# Altium schematic sheet MosfetDrivers.SchDoc
size 420 x 297 mm; Author: Denizhan ALTAY; SheetNumber: 3; SheetTotal: 4
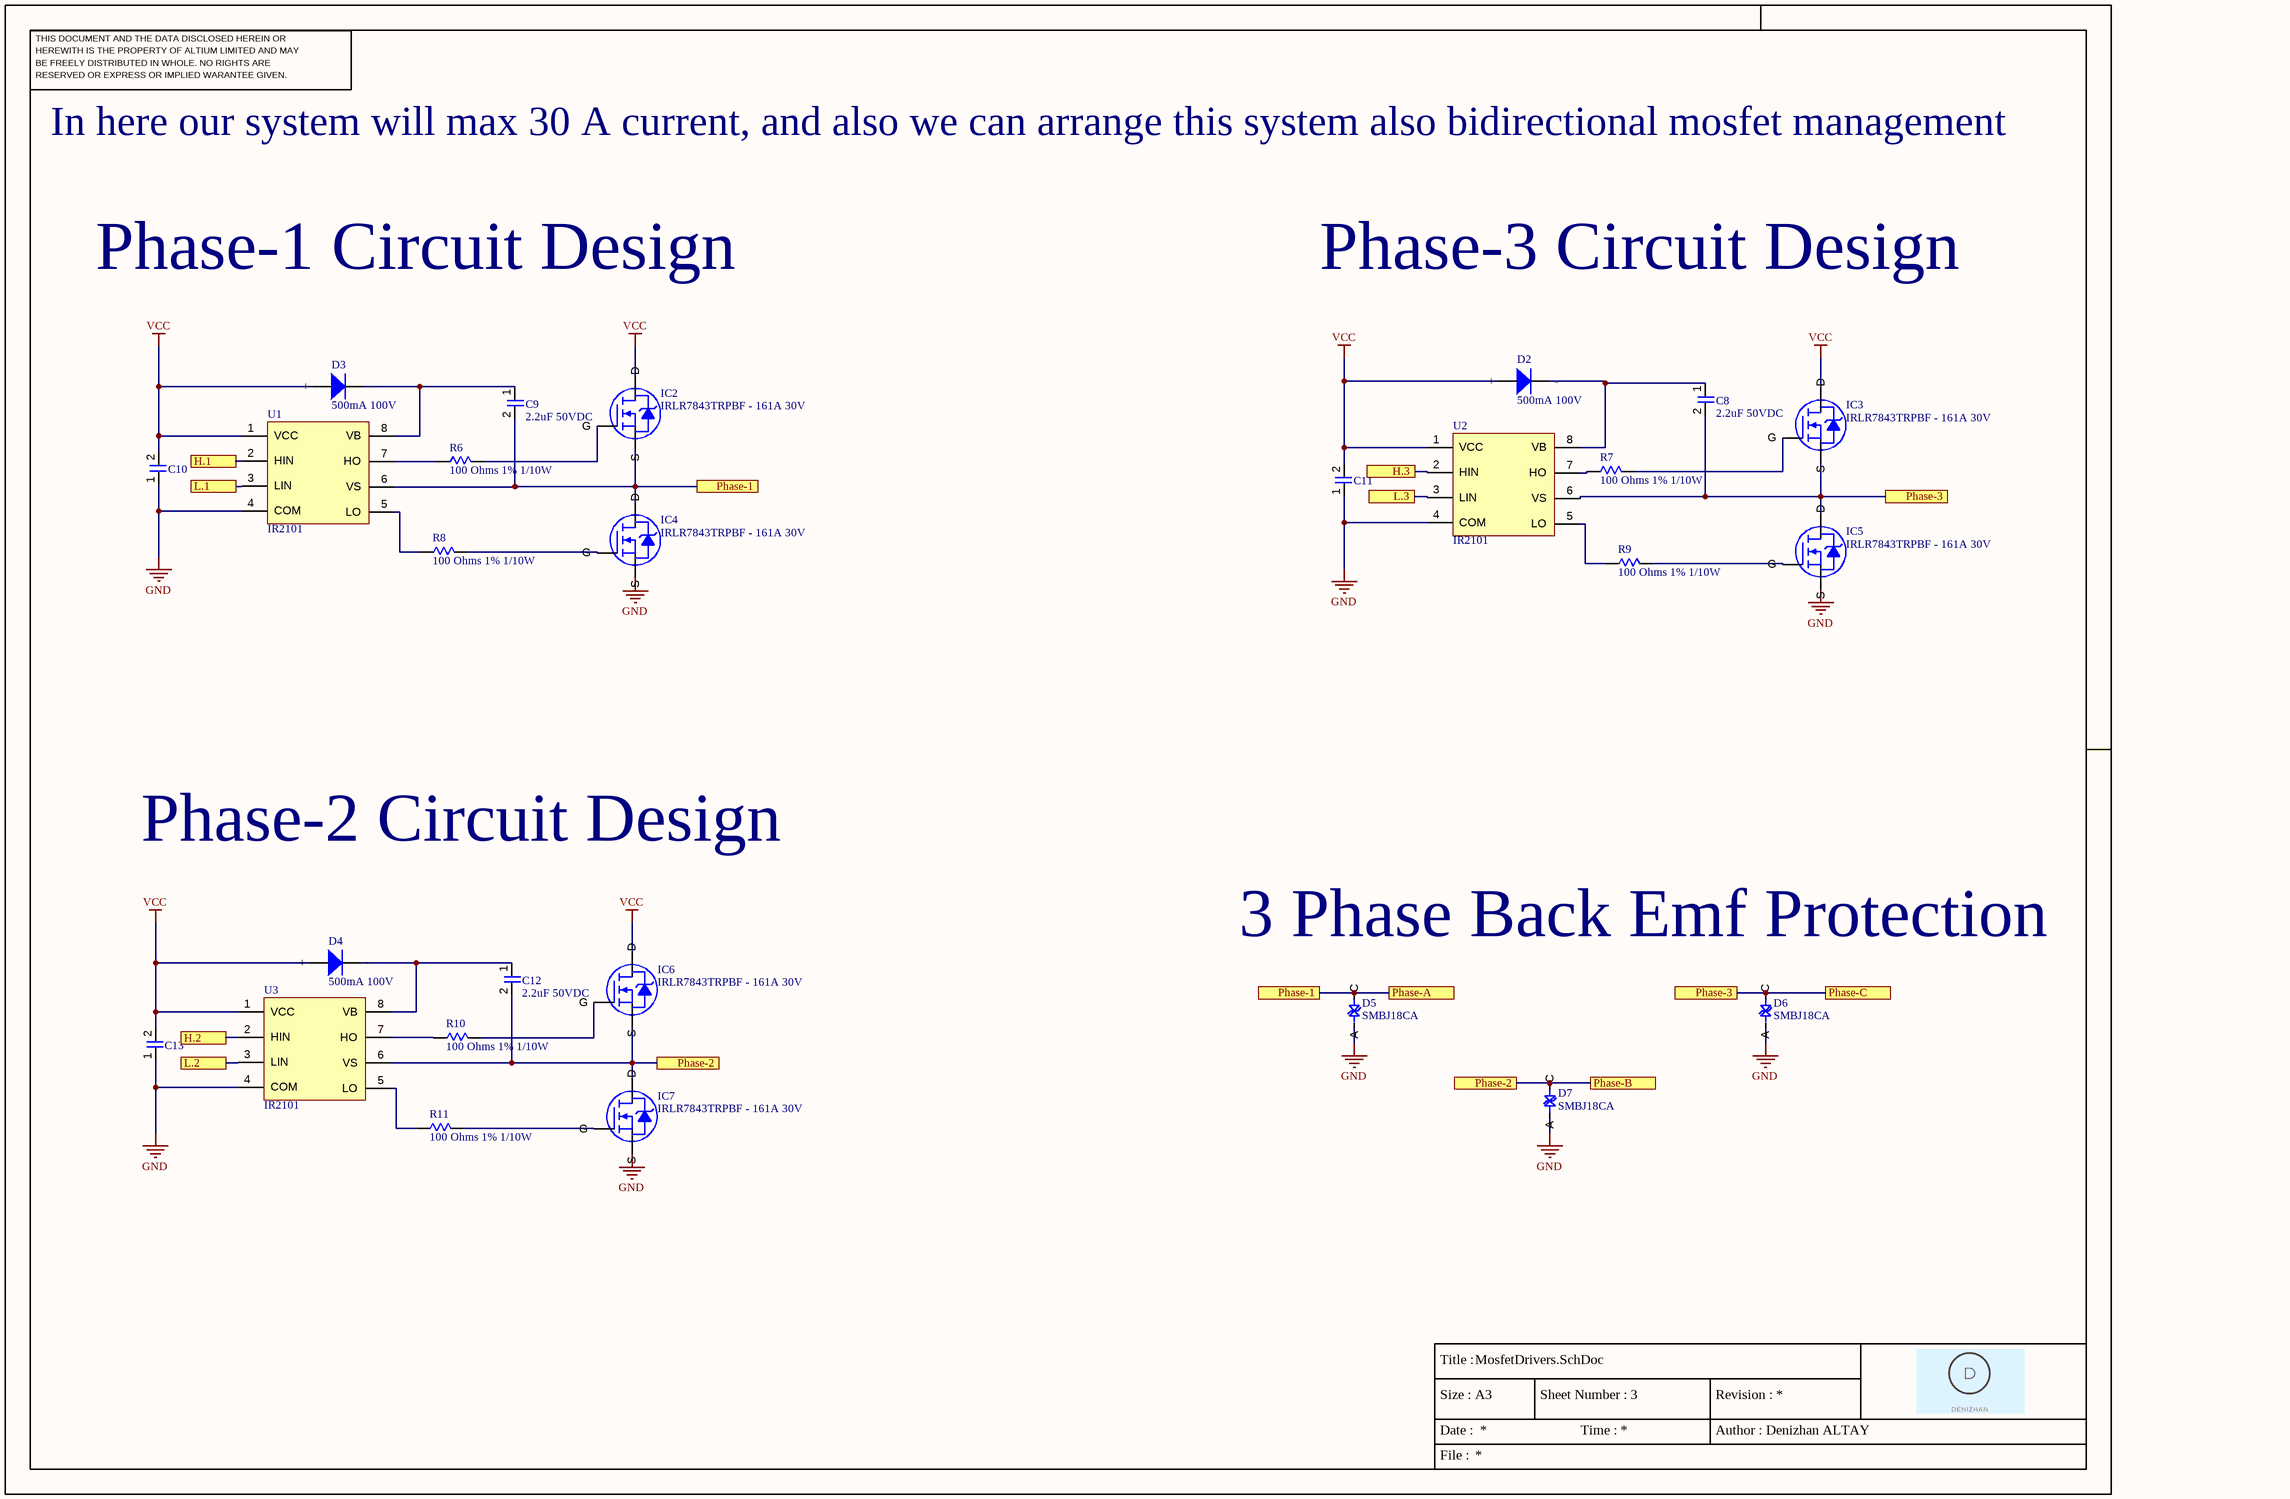
[diagram p0: MosfetDrivers.SchDoc]

## Parts
C8  2.2uF 50VDC  [0603_UnP_Capacitor]
C9  2.2uF 50VDC  [0603_UnP_Capacitor]
C10  10uF 50VDC  [0805_Capacitor_Special_CC0805KKX7R9BB106]  (value not drawn)
C11  10uF 50VDC  [0805_Capacitor_Special_CC0805KKX7R9BB106]  (value not drawn)
C12  2.2uF 50VDC  [0603_UnP_Capacitor]
C13  10uF 50VDC  [0805_Capacitor_Special_CC0805KKX7R9BB106]  (value not drawn)
D2  500mA 100V  [1N4148_Diode]
D3  500mA 100V  [1N4148_Diode]
D4  500mA 100V  [1N4148_Diode]
D5  SMBJ18CA  [SMBJ18CA-TKS]
D6  SMBJ18CA  [SMBJ18CA-TKS]
D7  SMBJ18CA  [SMBJ18CA-TKS]
IC2  IRLR7843TRPBF - 161A 30V  [IRLR7843_DPAK229P991X239-3N]
IC3  IRLR7843TRPBF - 161A 30V  [IRLR7843_DPAK229P991X239-3N]
IC4  IRLR7843TRPBF - 161A 30V  [IRLR7843_DPAK229P991X239-3N]
IC5  IRLR7843TRPBF - 161A 30V  [IRLR7843_DPAK229P991X239-3N]
IC6  IRLR7843TRPBF - 161A 30V  [IRLR7843_DPAK229P991X239-3N]
IC7  IRLR7843TRPBF - 161A 30V  [IRLR7843_DPAK229P991X239-3N]
R6  100 Ohms 1% 1/10W  [0603_Resistor_Case]
R7  100 Ohms 1% 1/10W  [0603_Resistor_Case]
R8  100 Ohms 1% 1/10W  [0603_Resistor_Case]
R9  100 Ohms 1% 1/10W  [0603_Resistor_Case]
R10  100 Ohms 1% 1/10W  [0603_Resistor_Case]
R11  100 Ohms 1% 1/10W  [0603_Resistor_Case]
U1  IR2101  [IR2101_SOIC127P600X175-8N]
U2  IR2101  [IR2101_SOIC127P600X175-8N]
U3  IR2101  [IR2101_SOIC127P600X175-8N]

## Ports
H.1 (see Atmega328PB[4A]), H.2 (see Atmega328PB[3B]), H.3 (see Atmega328PB[3A]), L.1 (see Atmega328PB[4A]), L.2 (see Atmega328PB[3B]), L.3 (see Atmega328PB[3A]), Phase-1 (see Atmega328PB[6B], MosfetDrivers[2B]), Phase-1 (see Atmega328PB[6B], MosfetDrivers[4C]), Phase-2 (see Atmega328PB[6B], MosfetDrivers[2C]), Phase-2 (see Atmega328PB[6B], MosfetDrivers[5C]), Phase-3 (see Atmega328PB[6B], MosfetDrivers[5C]), Phase-3 (see Atmega328PB[6B], MosfetDrivers[6B]), Phase-A, Phase-B, Phase-C

## Nets
GND: C10.1 C11.1 C13.1 D5.2(A) D6.2(A) D7.2(A) IC4.3(S) IC5.3(S) IC7.3(S) U1.4(COM) U2.4(COM) U3.4(COM)
VCC: C10.2 C11.2 C13.2 D2.1(+) D3.1(+) D4.1(+) IC2.4(D) IC3.4(D) IC6.4(D) U1.1(VCC) U2.1(VCC) U3.1(VCC)
H.1: U1.2(HIN) ; port H.1
H.2: U3.2(HIN) ; port H.2
H.3: U2.2(HIN) ; port H.3
L.1: U1.3(LIN) ; port L.1
L.2: U3.3(LIN) ; port L.2
L.3: U2.3(LIN) ; port L.3
Phase-1: C9.2 D5.1(C) IC2.3(S) IC4.4(D) U1.6(VS) ; port Phase-1, port Phase-A
Phase-2: C12.2 D7.1(C) IC6.3(S) IC7.4(D) U3.6(VS) ; port Phase-2, port Phase-B
Phase-3: C8.2 D6.1(C) IC3.3(S) IC5.4(D) U2.6(VS) ; port Phase-3, port Phase-C
NetC8_1: C8.1 D2.2(-) U2.8(VB)
NetC9_1: C9.1 D3.2(-) U1.8(VB)
NetC12_1: C12.1 D4.2(-) U3.8(VB)
NetIC2_1: IC2.1(G) R6.2
NetIC3_1: IC3.1(G) R7.2
NetIC4_1: IC4.1(G) R8.2
NetIC5_1: IC5.1(G) R9.2
NetIC6_1: IC6.1(G) R10.2
NetIC7_1: IC7.1(G) R11.2
NetR6_1: R6.1 U1.7(HO)
NetR7_1: R7.1 U2.7(HO)
NetR8_1: R8.1 U1.5(LO)
NetR9_1: R9.1 U2.5(LO)
NetR10_1: R10.1 U3.7(HO)
NetR11_1: R11.1 U3.5(LO)

## Notes on the sheet
- In here our system will max 30 A current, and also we can arrange this system also bidirectional mosfet management
- Phase-1 Circuit Design
- Phase-3 Circuit Design
- Phase-2 Circuit Design
- 3 Phase Back Emf Protection
- THIS DOCUMENT AND THE DATA DISCLOSED HEREIN OR
- HEREWITH IS THE PROPERTY OF ALTIUM LIMITED AND MAY
- BE FREELY DISTRIBUTED IN WHOLE. NO RIGHTS ARE
- RESERVED OR EXPRESS OR IMPLIED WARANTEE GIVEN.
- Title :
- Size :
- Date :
- A3
- Sheet Number :
- Time :
- Revision :
- Author :
- File :

## Library data of the parts
C8 C9 C12 = UMK107BBJ225KA-T - MLCC 0603 2.2uF 50VDC ±10% X5R: Manufacturer: YUDEN; Capacitor Type: Ceramic; Max Working Voltage: 50V; Library Ref: Capacitors; Package / Case: 0603; Capacitor Value: 2.2uF; Part Number: UMK107BBJ225KA-T; ComponentLink1Description: New link; ComponentLink1URL: https://www.ozdisan.com/passive-components/resistors/smt-smd-and-chip-resistors/PS03W4F1003T5E/592727
C10 C11 C13 = CC0805KKX7R9BB106 - MLCC 0805 10uF 50VDC ±10% X7R: Manufacturer: YAGEO; Capacitor Type: Unpolarized; Library Ref: Capacitors; Package / Case: 0805; Capacitor Value: 10uF; Part Number: CC0805KKX7R9BB106; ComponentLink1Description: New link; ComponentLink1URL: https://www.ozdisan.com/passive-components/capacitors/smt-smd-and-mlcc-capacitors/CL10B392KB8NNNC/26336; Max Working Voltage: 50VDC
D2-D4 = 1N4148-35_AY_10001 - DIODE SWITCHING Single 500mA 100V THT DO35: Library Ref: Diodes; Diode Types: Switching
D5-D7 = SMBJ18CA-TKS - DIODE TVS 600W 18V DO214AA: SMBJ18CA-TKS - DIODE TVS 600W 18V DO214AA (SMB) SMT; MF: THINKING ELECTRONIC; Diode Direction: Bidirectional; Package: SMD; Price: None; Library Ref: Diodes; MP: SMBJ18CA-TKS; Availability: Available; Type: TVS
IC2-IC7 = IRLR7843TRPBF - MOSFET DIS.161A 30V N-CH TO252(DPAK) HEXFET SMT: Mosfet Type: N; Library Ref: Mosfets; Package / Case: D-Pack
R6-R11 = CQ03SAF1000T5E - 0603 100 Ohms 1% 1/10W AUTOMOTIV: Manufacturer: ROYALOHM; Working Voltage (Max): 75V; Library Ref: Resistors; Package / Case: 0603; Power (Watts): 1/10W; Resistor Value: 100 Ohms; Part Number: CQ03SAF1000T5E; ComponentLink1Description: New link; ComponentLink1URL: https://www.ozdisan.com/passive-components/resistors/smt-smd-and-chip-resistors/PS03W4F1003T5E/592727
U1-U3 = IR2101: High Speed power MOSFET and IGBT driver; Library Ref: Mosfet Controllers